# Altium schematic sheet PS2.SchDoc
size A3
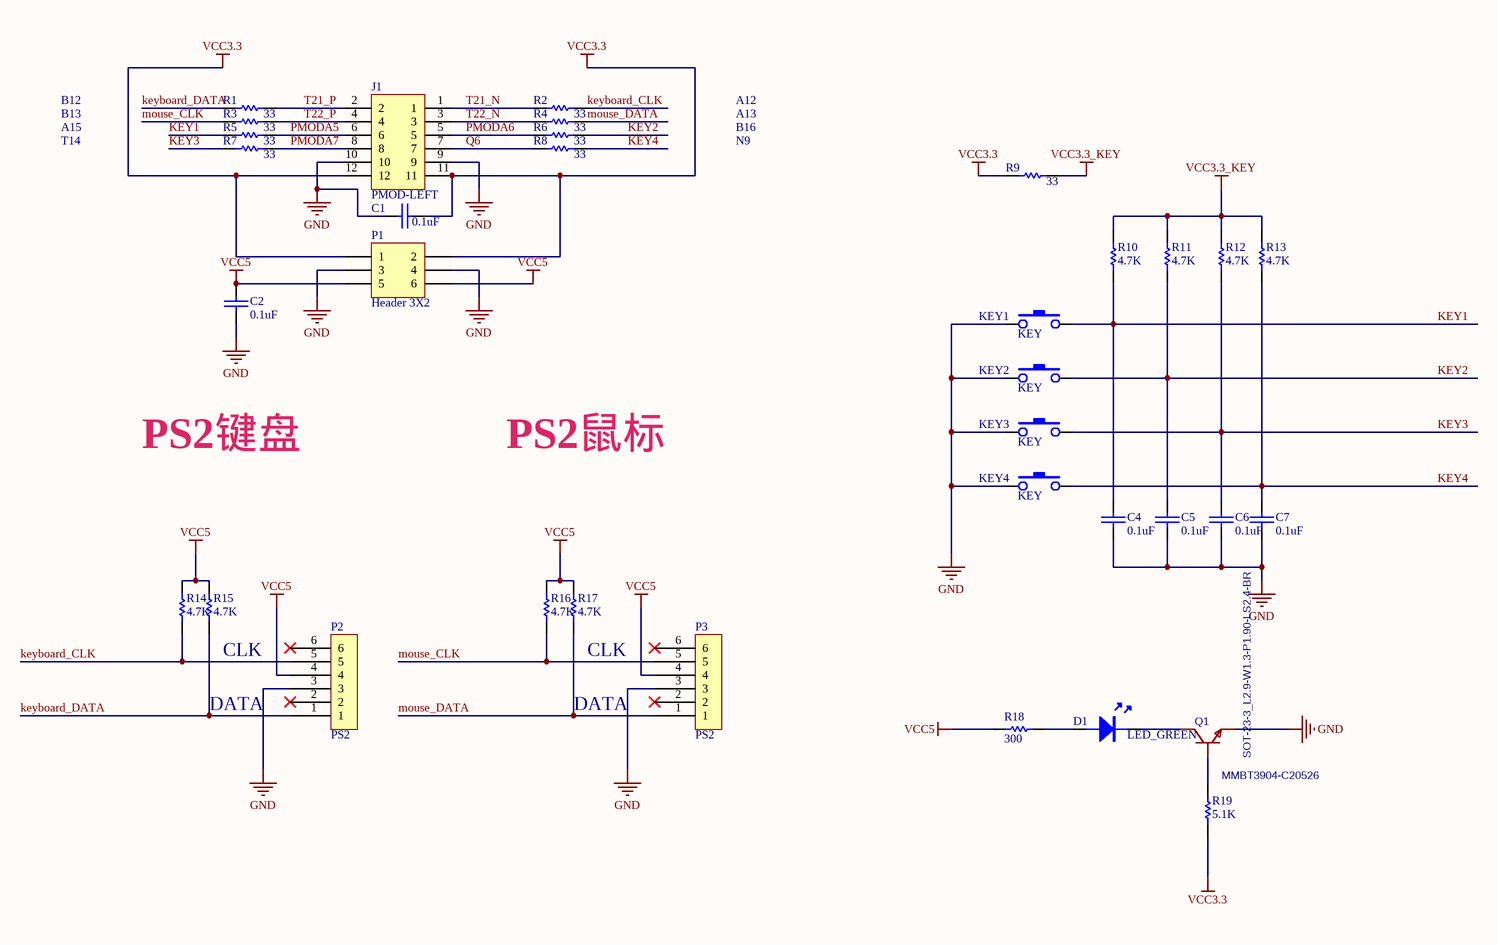
[diagram p0: PS2.SchDoc]

## Parts
C1  0.1uF  [0603C]
C2  0.1uF  [0603C]
C4  0.1uF  [0603C]
C5  0.1uF  [0603C]
C6  0.1uF  [0603C]
C7  0.1uF  [0603C]
D1  LED_GREEN  [LED-0603G]
J1  PMOD-LEFT  [2X6P RIGHT]
KEY1  KEY  [SMD-3X6X2.5]
KEY2  KEY  [SMD-3X6X2.5]
KEY3  KEY  [SMD-3X6X2.5]
KEY4  KEY  [SMD-3X6X2.5]
P1  Header 3X2  [HDR2X3]
P2  PS2  [PS2]
P3  PS2  [PS2]
Q1  MMBT3904-C20526  [SOT-23-3_L2.9-W1.3-P1.90-LS2.4-BR]
R1  33  [0603_Q0603A]
R2  33  [0603_Q0603A]
R3  33  [0603_Q0603A]
R4  33  [0603_Q0603A]
R5  33  [0603_Q0603A]
R6  33  [0603_Q0603A]
R7  33  [0603_Q0603A]
R8  33  [0603_Q0603A]
R9  33  [0603_Q0603A]
R10  4.7K  [0603_Q0603A]
R11  4.7K  [0603_Q0603A]
R12  4.7K  [0603_Q0603A]
R13  4.7K  [0603_Q0603A]
R14  4.7K  [0603_Q0603A]
R15  4.7K  [0603_Q0603A]
R16  4.7K  [0603_Q0603A]
R17  4.7K  [0603_Q0603A]
R18  300  [0603_Q0603A]
R19  5.1K  [0603_Q0603A]

## Nets
GND: C1.1 C2.1 C4.1 C5.1 C6.1 C7.1 J1.9 J1.10 KEY1.1 KEY2.1 KEY3.1 KEY4.1 P1.3 P1.4 P2.3 P3.3 Q1.2(E)
VCC3.3: C1.2 J1.11 J1.12 P1.1 P1.2 R9.1 R19.1
VCC3.3_KEY: R9.2 R10.2 R11.2 R12.2 R13.2
VCC5: C2.2 P1.5 P1.6 P2.4 P3.4 R14.2 R15.2 R16.2 R17.2 R18.1
KEY1: C4.2 KEY1.3 R5.1 R10.1
KEY2: C5.2 KEY2.3 R6.2 R11.1
KEY3: C6.2 KEY3.3 R7.1 R12.1
KEY4: C7.2 KEY4.3 R8.2 R13.1
keyboard_CLK: P2.5 R2.2 R14.1
keyboard_DATA: P2.1 R1.1 R15.1
mouse_CLK: P3.5 R3.1 R16.1
mouse_DATA: P3.1 R4.2 R17.1
PMODA5: J1.6 R5.2
PMODA6: J1.5 R6.1
PMODA7: J1.8 R7.2
Q6: J1.7 R8.1
T21_N: J1.1 R2.1
T21_P: J1.2 R1.2
T22_N: J1.3 R4.1
T22_P: J1.4 R3.2
NetD1_A: D1.A R18.2
NetD1_K: D1.K Q1.3(C)
NetQ1_1: Q1.1(B) R19.2

Not connected (* = marked no-connect by the designer): P2 2* 6*; P3 2* 6*

## Notes on the sheet
- B12
- B13
- A12
- A13
- A15
- T14
- B16
- N9
- PS2键盘
- PS2鼠标
- (near R15) CLK
- (near R17) CLK
- DATA
- (in symbol MMBT3904-C20526) SOT-23-3_L2.9-W1.3-P1.90-LS2.4-BR

## Library data of the parts
C1 C2 C4-C7 = CAP: 无极性电容
D1 = LED
J1 = Female HDR2X6
P1 = Header 3X2: Header, 3-Pin, Dual row; LatestRevisionDate: 17-Jul-2002; LatestRevisionNote: Re-released for DXP Platform.; Publisher: Altium Limited
Q1 = MMBT3904-C20526: BOM_Manufacturer: CJ; SMT Type: Basic; Contributor: 立创EDA官方封装库; Package Display: Yes; BOM_Supplier: LCSC; BOM_Manufacturer Part: MMBT3904; BOM_Supplier Part: C20526; BOM_JLCPCB SMD: Yes; spicePre: Q; spiceSymbolName: MMBT3904-C20526
R1-R19 = RES